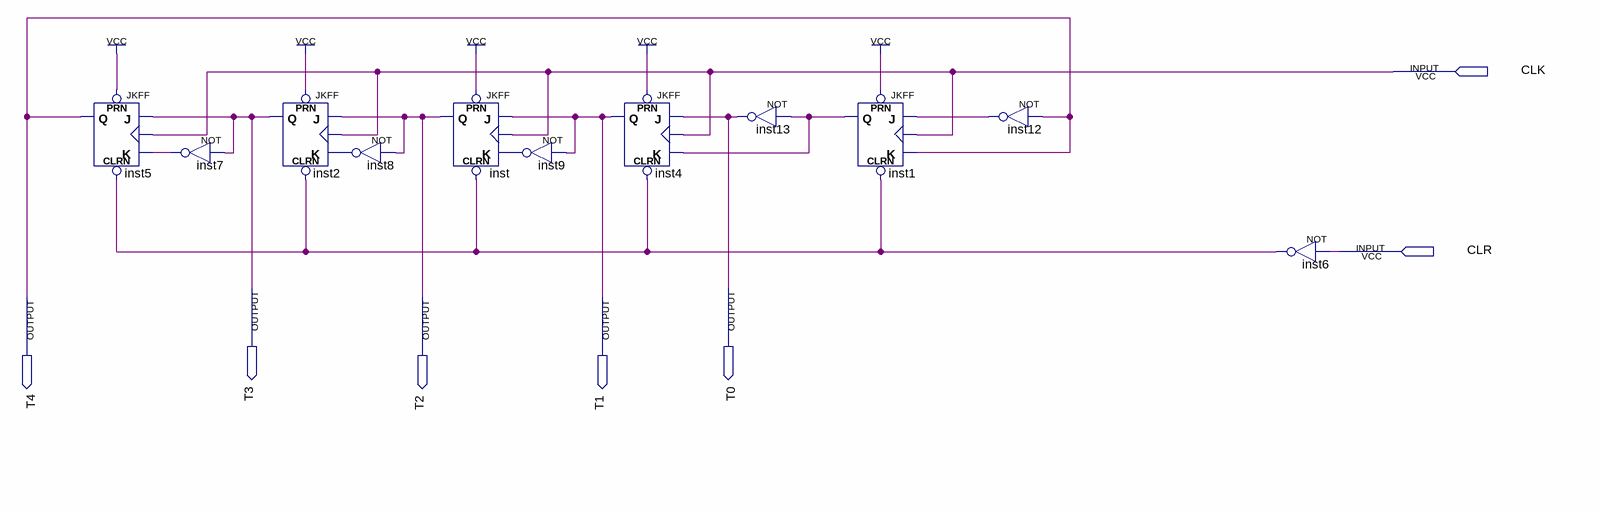
[diagram p0: schematic sheet]
// Quartus schematic CONTADOR_EM_ANEL.bdf as structural Verilog: 11 symbols, 7 pins
module CONTADOR_EM_ANEL (
  input  CLK,
  input  CLR,
  output T3,
  output T0,
  output T4,
  output T2,
  output T1
);

  wire inst1_q, inst6_out, inst7_out, inst8_out, inst9_out, inst12_out;

  JKFF inst5 (.PRN(1'b1), .CLRN(inst6_out), .K(inst7_out), .J(T3), .CLK(CLK), .Q(T4));
  not inst7 (inst7_out, T3);
  JKFF inst2 (.PRN(1'b1), .CLRN(inst6_out), .K(inst8_out), .J(T2), .CLK(CLK), .Q(T3));
  not inst8 (inst8_out, T2);
  JKFF inst (.PRN(1'b1), .CLRN(inst6_out), .K(inst9_out), .J(T1), .CLK(CLK), .Q(T2));
  not inst9 (inst9_out, T1);
  JKFF inst4 (.PRN(1'b1), .CLRN(inst6_out), .K(inst1_q), .J(T0), .CLK(CLK), .Q(T1));
  not inst13 (T0, inst1_q);
  JKFF inst1 (.PRN(1'b1), .CLRN(inst6_out), .K(T4), .J(inst12_out), .CLK(CLK), .Q(inst1_q));
  not inst12 (inst12_out, T4);
  not inst6 (inst6_out, CLR);
endmodule
